# EAGLE design pet_csadapter-v1.2a (EAGLE 4.15)
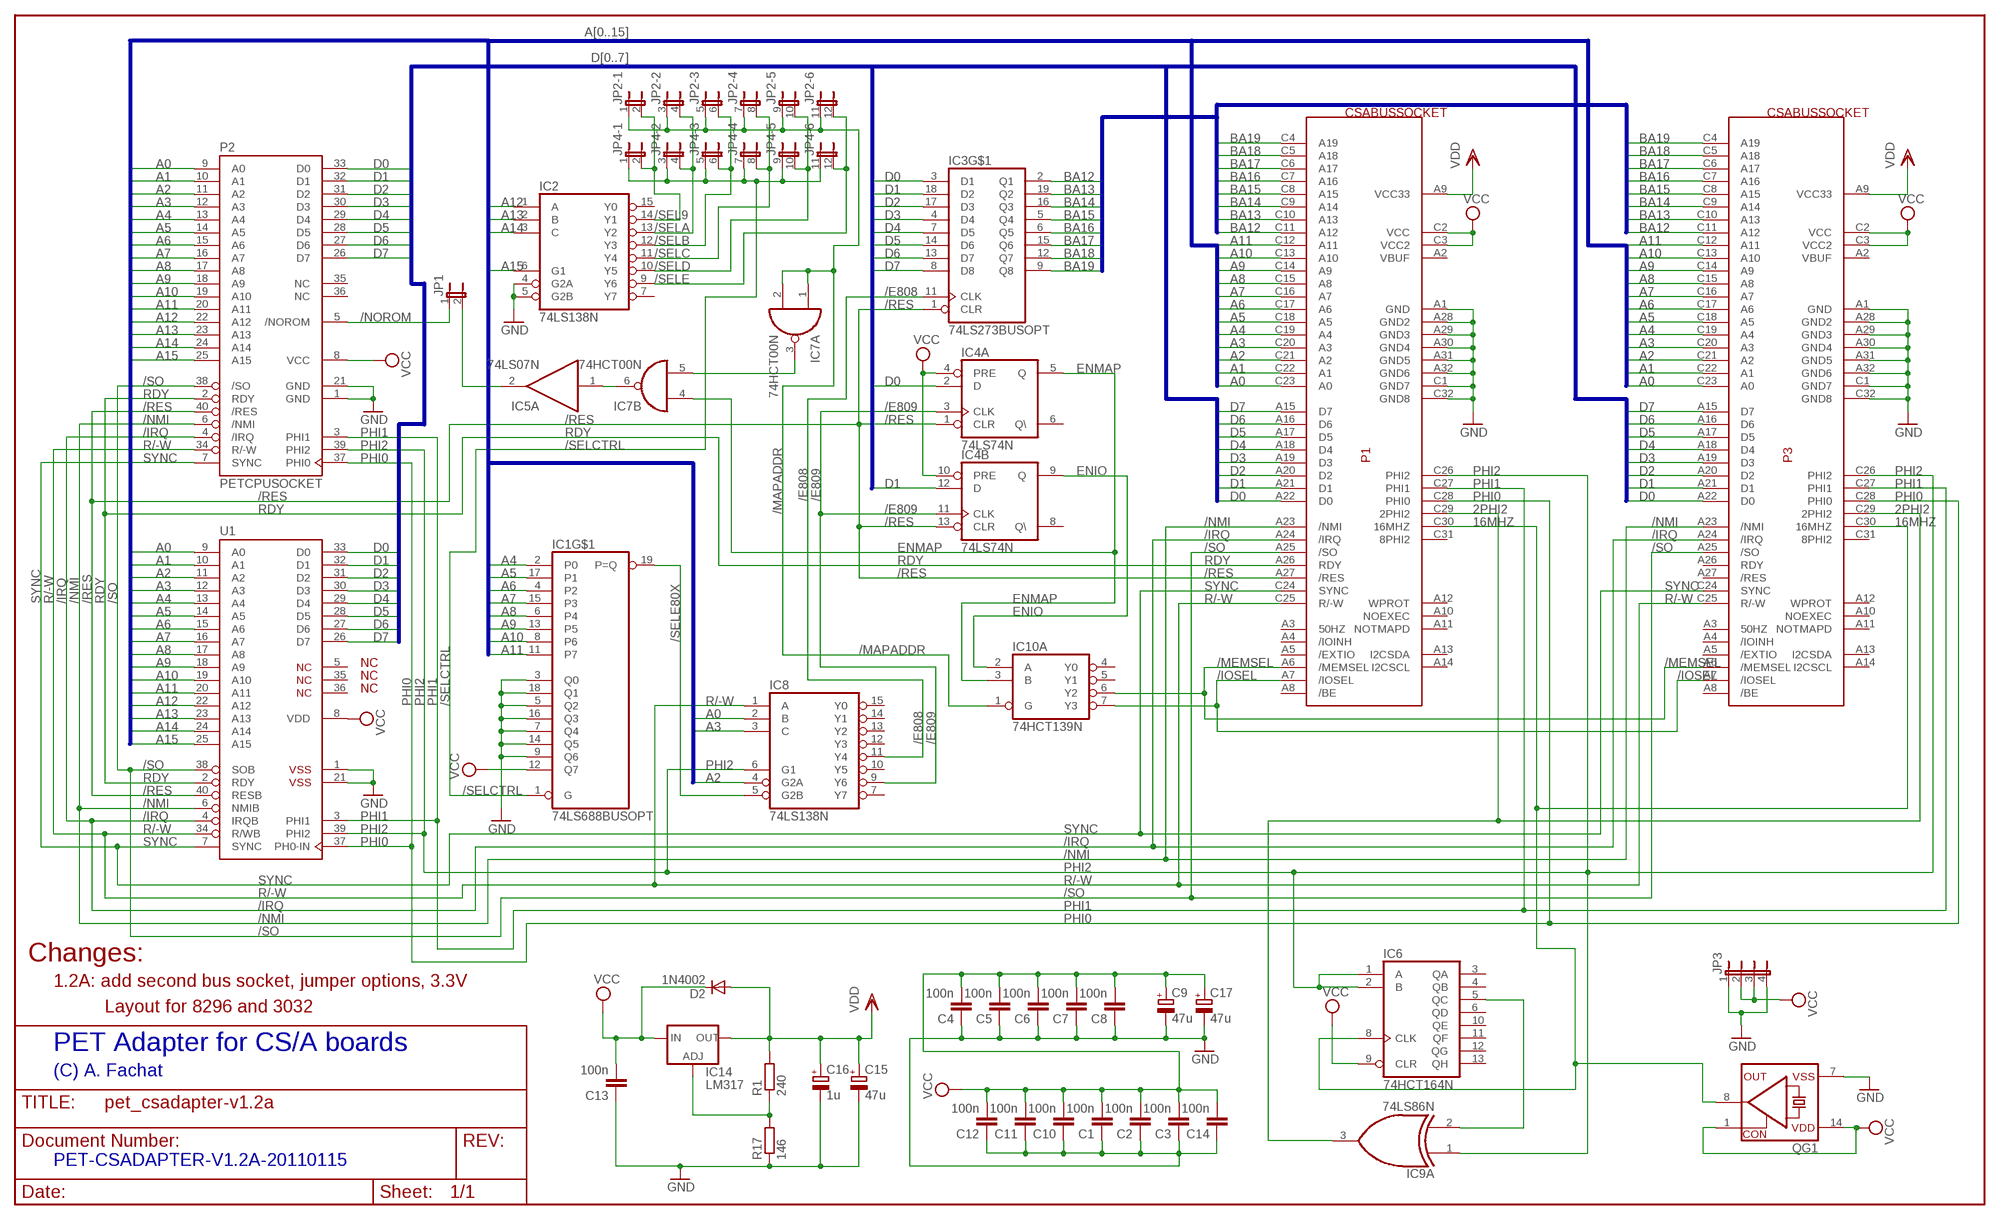
[diagram p0: schematic, sheet 1]

## Parts
C1  100n  C-EU025-025X050  [C025-025X050]
C2  100n  C-EU025-025X050  [C025-025X050]
C3  100n  C-EU025-025X050  [C025-025X050]
C4  100n  C-EU025-025X050  [C025-025X050]
C5  100n  C-EU025-025X050  [C025-025X050]
C6  100n  C-EU025-025X050  [C025-025X050]
C7  100n  C-EU025-025X050  [C025-025X050]
C8  100n  C-EU025-025X050  [C025-025X050]
C9  47u  CPOL-EUE2.5-5  [E2,5-5]
C10  100n  C-EU025-025X050  [C025-025X050]
C11  100n  C-EU025-025X050  [C025-025X050]
C12  100n  C-EU025-025X050  [C025-025X050]
C13  100n  C5/2.5  [C5B2.5]
C14  100n  C-EU025-025X050  [C025-025X050]
C15  47u  CPOL-EUE2-5  [E2-5]
C16  1u  CPOL-EUE2.5-5  [E2,5-5]
C17  47u  CPOL-EUE2.5-5  [E2,5-5]
D2  1N4002  DIODE-C1702-15  [C1702-15]
IC1  74LS688BUSOPT  [DIL20]
IC2  74LS138N  [DIL16]
IC3  74LS273BUSOPT  [DIL20]
IC4  74LS74N  [DIL14]
IC5  74LS07N  [DIL14]
IC6  74HCT164N  [DIL14]
IC7  74HCT00N  [DIL14]
IC8  74LS138N  [DIL16]
IC9  74LS86N  [DIL14]
IC10  74HCT139N  [DIL16]
IC14  LM317  LM317TL  [317TL]
JP1  JP1E  [JP1]
JP2  JP6QE  [JP6Q]
JP3  JP4E  [JP4]
JP4  JP6QE  [JP6Q]
P1  CSABUSSOCKET  [CSABUSSOCK]
P2  PETCPUSOCKET  [DIL40]
P3  CSABUSSOCKET  [CSABUSSOCK]
QG1  CRYSTAL_RES-SG51  [SG51]
R1  240  R-EU_0204/5  [0204/5]
R17  146  R-EU_0204/5  [0204/5]
U1  G65SC02P  [DIP-40]

## Nets
2PHI2: IC9.3(A:O) P1.C29(2PHI2) P3.C29(2PHI2)
16MHZ: IC6.8(CLK) P1.C30(16MHZ) P3.C30(16MHZ) QG1.8(OUT)
/E808: IC3.11(CLK) IC8.11(Y4)
/E809: IC4.3(A:CLK) IC4.11(B:CLK) IC8.9(Y6)
/IOSEL: IC10.7(A:Y3) P1.A7(/IOSEL) P3.A7(/IOSEL)
/IRQ: P1.A24(/IRQ) P2.4(/IRQ) P3.A24(/IRQ) U1.4(IRQB)
/MAPADDR: IC7.1(A:I0) IC7.2(A:I1) IC10.1(A:G) JP2.1 JP2.3 JP2.5 JP2.7 JP2.9 JP2.11
/MEMSEL: IC10.6(A:Y2) P1.A6(/MEMSEL) P3.A6(/MEMSEL)
/NMI: P1.A23(/NMI) P2.6(/NMI) P3.A23(/NMI) U1.6(NMIB)
/NOROM: JP1.1 P2.5(/NOROM)
/RES: IC3.1(CLR) IC4.1(A:CLR) IC4.13(B:CLR) P1.A27(/RES) P2.40(/RES) U1.40(RESB)
/SEL9: IC2.14(Y1) JP2.2 JP4.2
/SELA: IC2.13(Y2) JP2.4 JP4.4
/SELB: IC2.12(Y3) JP2.6 JP4.6
/SELC: IC2.11(Y4) JP2.8 JP4.8
/SELCTRL: IC1.1(G) JP4.1 JP4.3 JP4.5 JP4.7 JP4.9 JP4.11
/SELD: IC2.10(Y5) JP2.10 JP4.10
/SELE: IC2.9(Y6) JP2.12 JP4.12
/SELE80X: IC1.19(P=Q) IC8.5(G2B)
/SO: P1.A25(/SO) P2.38(/SO) P3.A25(/SO) U1.38(SOB)
A0: IC8.2(B) P1.C23(A0) P2.9(A0) P3.C23(A0) U1.9(A0)
A1: P1.C22(A1) P2.10(A1) P3.C22(A1) U1.10(A1)
A2: IC8.4(G2A) P1.C21(A2) P2.11(A2) P3.C21(A2) U1.11(A2)
A3: IC8.3(C) P1.C20(A3) P2.12(A3) P3.C20(A3) U1.12(A3)
A4: IC1.2(P0) P1.C19(A4) P2.13(A4) P3.C19(A4) U1.13(A4)
A5: IC1.17(P1) P1.C18(A5) P2.14(A5) P3.C18(A5) U1.14(A5)
A6: IC1.4(P2) P1.C17(A6) P2.15(A6) P3.C17(A6) U1.15(A6)
A7: IC1.15(P3) P1.C16(A7) P2.16(A7) P3.C16(A7) U1.16(A7)
A8: IC1.6(P4) P1.C15(A8) P2.17(A8) P3.C15(A8) U1.17(A8)
A9: IC1.13(P5) P1.C14(A9) P2.18(A9) P3.C14(A9) U1.18(A9)
A10: IC1.8(P6) P1.C13(A10) P2.19(A10) P3.C13(A10) U1.19(A10)
A11: IC1.11(P7) P1.C12(A11) P2.20(A11) P3.C12(A11) U1.20(A11)
A12: IC2.1(A) P2.22(A12) U1.22(A12)
A13: IC2.2(B) P2.23(A13) U1.23(A13)
A14: IC2.3(C) P2.24(A14) U1.24(A14)
A15: IC2.6(G1) P2.25(A15) U1.25(A15)
BA12: IC3.2(Q1) P1.C11(A12) P3.C11(A12)
BA13: IC3.19(Q2) P1.C10(A13) P3.C10(A13)
BA14: IC3.16(Q3) P1.C9(A14) P3.C9(A14)
BA15: IC3.5(Q4) P1.C8(A15) P3.C8(A15)
BA16: IC3.6(Q5) P1.C7(A16) P3.C7(A16)
BA17: IC3.15(Q6) P1.C6(A17) P3.C6(A17)
BA18: IC3.12(Q7) P1.C5(A18) P3.C5(A18)
BA19: IC3.9(Q8) P1.C4(A19) P3.C4(A19)
D0: IC3.3(D1) IC4.2(A:D) P1.A22(D0) P2.33(D0) P3.A22(D0) U1.33(D0)
D1: IC3.18(D2) IC4.12(B:D) P1.A21(D1) P2.32(D1) P3.A21(D1) U1.32(D1)
D2: IC3.17(D3) P1.A20(D2) P2.31(D2) P3.A20(D2) U1.31(D2)
D3: IC3.4(D4) P1.A19(D3) P2.30(D3) P3.A19(D3) U1.30(D3)
D4: IC3.7(D5) P1.A18(D4) P2.29(D4) P3.A18(D4) U1.29(D4)
D5: IC3.14(D6) P1.A17(D5) P2.28(D5) P3.A17(D5) U1.28(D5)
D6: IC3.13(D7) P1.A16(D6) P2.27(D6) P3.A16(D6) U1.27(D6)
D7: IC3.8(D8) P1.A15(D7) P2.26(D7) P3.A15(D7) U1.26(D7)
ENIO: IC4.9(B:Q) IC10.2(A:A)
ENMAP: IC4.5(A:Q) IC7.4(B:I0) IC10.3(A:B)
GND: C1.1 C2.1 C3.1 C4.1 C5.1 C6.1 C7.1 C8.1 C9.- C10.1 C11.1 C12.1 C13.1 C14.1 C15.- C16.- C17.- IC1.3(Q0) IC1.5(Q2) IC1.7(Q4) IC1.9(Q6) IC1.14(Q5) IC1.16(Q3) IC1.18(Q1) IC2.4(G2A) IC2.5(G2B) JP3.1 JP3.4 P1.A1(GND) P1.A28(GND2) P1.A29(GND3) P1.A30(GND4) P1.A31(GND5) P1.A32(GND6) P1.C1(GND7) P1.C32(GND8) P2.1(GND) P2.21(GND) P3.A1(GND) P3.A28(GND2) P3.A29(GND3) P3.A30(GND4) P3.A31(GND5) P3.A32(GND6) P3.C1(GND7) P3.C32(GND8) QG1.7(VSS) R17.1 U1.1(VSS$1) U1.21(VSS$2)
N$1: IC5.2(A:O) JP1.2
N$2: IC14.1(ADJ) R1.1 R17.2
N$5: IC6.5(QC) IC9.2(A:I1)
N$7: IC5.1(A:I) IC7.6(B:O)
N$9: IC7.3(A:O) IC7.5(B:I1)
PHI0: P1.C28(PHI0) P2.37(PHI0) P3.C28(PHI0) U1.37(PH0-IN)
PHI1: P1.C27(PHI1) P2.3(PHI1) P3.C27(PHI1) U1.3(PHI1)
PHI2: IC6.1(A) IC6.2(B) IC8.6(G1) IC9.1(A:I0) P1.C26(PHI2) P2.39(PHI2) P3.C26(PHI2) U1.39(PHI2)
R/-W: IC8.1(A) P1.C25(R/-W) P2.34(R/-W) P3.C25(R/-W) U1.34(R/WB)
RDY: P1.A26(RDY) P2.2(RDY) U1.2(RDY)
SYNC: P1.C24(SYNC) P2.7(SYNC) P3.C24(SYNC) U1.7(SYNC)
VCC: C1.2 C2.2 C3.2 C4.2 C5.2 C6.2 C7.2 C8.2 C9.+ C10.2 C11.2 C12.2 C13.2 C14.2 C17.+ D2.C IC1.12(Q7) IC4.4(A:PRE) IC4.10(B:PRE) IC6.9(CLR) IC14.3(IN) JP3.2 JP3.3 P1.C2(VCC) P1.C3(VCC2) P2.8(VCC) P3.C2(VCC) P3.C3(VCC2) QG1.1(CON) QG1.14(VDD) U1.8(VDD)
VDD: C15.+ C16.+ D2.A IC14.2(OUT) P1.A9(VCC33) P3.A9(VCC33) R1.2
Unconnected: IC2.7(Y7) IC2.15(Y0) IC4.6(A:Q\) IC4.8(B:Q\) IC5.3(B:I) IC5.4(B:O) IC5.5(C:I) IC5.6(C:O) IC5.8(D:O) IC5.9(D:I) IC5.10(E:O) IC5.11(E:I) IC5.12(F:O) IC5.13(F:I) IC6.3(QA) IC6.4(QB) IC6.6(QD) IC6.10(QE) IC6.11(QF) IC6.12(QG) IC6.13(QH) IC7.8(C:O) IC7.9(C:I0) IC7.10(C:I1) IC7.11(D:O) IC7.12(D:I0) IC7.13(D:I1) IC8.7(Y7) IC8.10(Y5) IC8.12(Y3) IC8.13(Y2) IC8.14(Y1) IC8.15(Y0) IC9.4(B:I0) IC9.5(B:I1) IC9.6(B:O) IC9.8(C:O) IC9.9(C:I0) IC9.10(C:I1) IC9.11(D:O) IC9.12(D:I0) IC9.13(D:I1) IC10.4(A:Y0) IC10.5(A:Y1) IC10.9(B:Y3) IC10.10(B:Y2) IC10.11(B:Y1) IC10.12(B:Y0) IC10.13(B:B) IC10.14(B:A) IC10.15(B:G) P1.A2(VBUF) P1.A3(50HZ) P1.A4(/IOINH) P1.A5(/EXTIO) P1.A8(/BE) P1.A10(NOEXEC) P1.A11(NOTMAPD) P1.A12(WPROT) P1.A13(I2CSDA) P1.A14(I2CSCL) P1.C31(8PHI2) P2.35(NC) P2.36(NC) P3.A2(VBUF) P3.A3(50HZ) P3.A4(/IOINH) P3.A5(/EXTIO) P3.A8(/BE) P3.A10(NOEXEC) P3.A11(NOTMAPD) P3.A12(WPROT) P3.A13(I2CSDA) P3.A14(I2CSCL) P3.A26(RDY) P3.A27(/RES) P3.C31(8PHI2) U1.5(NC$1) U1.35(NC$2) U1.36(NC$3)

## Buses
D[0..7]
A[0..15]
BA[12..19]

## Notes on the sheet
- Changes:
- 1.2A: add second bus socket, jumper options, 3.3V
- Layout for 8296 and 3032
- PET Adapter for CS/A boards
- (C) A. Fachat
- PET-CSADAPTER-V1.2A-20110115

## Power pins joined to a net without a drawn wire
GND: IC1.10(GND) IC2.8(GND) IC3.10(GND) IC4.7(P:GND) IC5.7(P:GND) IC6.7(GND) IC7.7(P:GND) IC8.8(GND) IC9.7(P:GND) IC10.8(P:GND)
VCC: IC1.20(VCC) IC2.16(VCC) IC3.20(VCC) IC4.14(P:VCC) IC5.14(P:VCC) IC6.14(VCC) IC7.14(P:VCC) IC8.16(VCC) IC9.14(P:VCC) IC10.16(P:VCC)

## Library data of the parts
C1-C8 C10-C12 C14 = rcl:C-EU: CAPACITOR, European symbol
C9 C15-C17 = rcl:CPOL-EU: POLARIZED CAPACITOR, European symbol
C13 = capacitor-wima:C: CAPACITOR naming: grid - package width
D2 = diode:DIODE-: DIODE
IC1 = csa:74LS688BUSOPT
IC2 IC8 = 74xx-us:74*138: 3-line to 8-line DECODER/DEMULTIPLEXER
IC3 = csa:74LS273BUSOPT
IC4 = 74xx-us:74*74: Dual D type positive edge triggered FLIP FLOP, preset and clear
IC5 = 74xx-eu:74*07: Hex BUFFER, open collector high-voltage output
IC6 = 74xx-eu:74*164: 8-bit parallel out SHIFT REGISTER
IC7 = 74xx-eu:74*00: Quad 2-input NAND gate
IC9 = 74xx-us:74*86: Quad 2-input EXCLUSIV-OR (XOR) gate
IC10 = 74xx-eu:74*139: Dual 2-line to 4-line DECODER/DEMULTIPLEXER
IC14 = v-reg:LM317TL: VOLTAGE REGULATOR
JP1 = jumper:JP1E: JUMPER
JP2 JP4 = jumper:JP6QE: JUMPER
JP3 = jumper:JP4E: JUMPER
P1 P3 = csa:CSABUS
P2 = csa:PETCPUSOCKET
QG1 = crystal:CRYSTAL_RES-: CRYSTAL RESONATOR
R1 R17 = rcl:R-EU_: RESISTOR, European symbol
U1 = 65xxx:G65SC02P: California Micro Devices Version

## Board
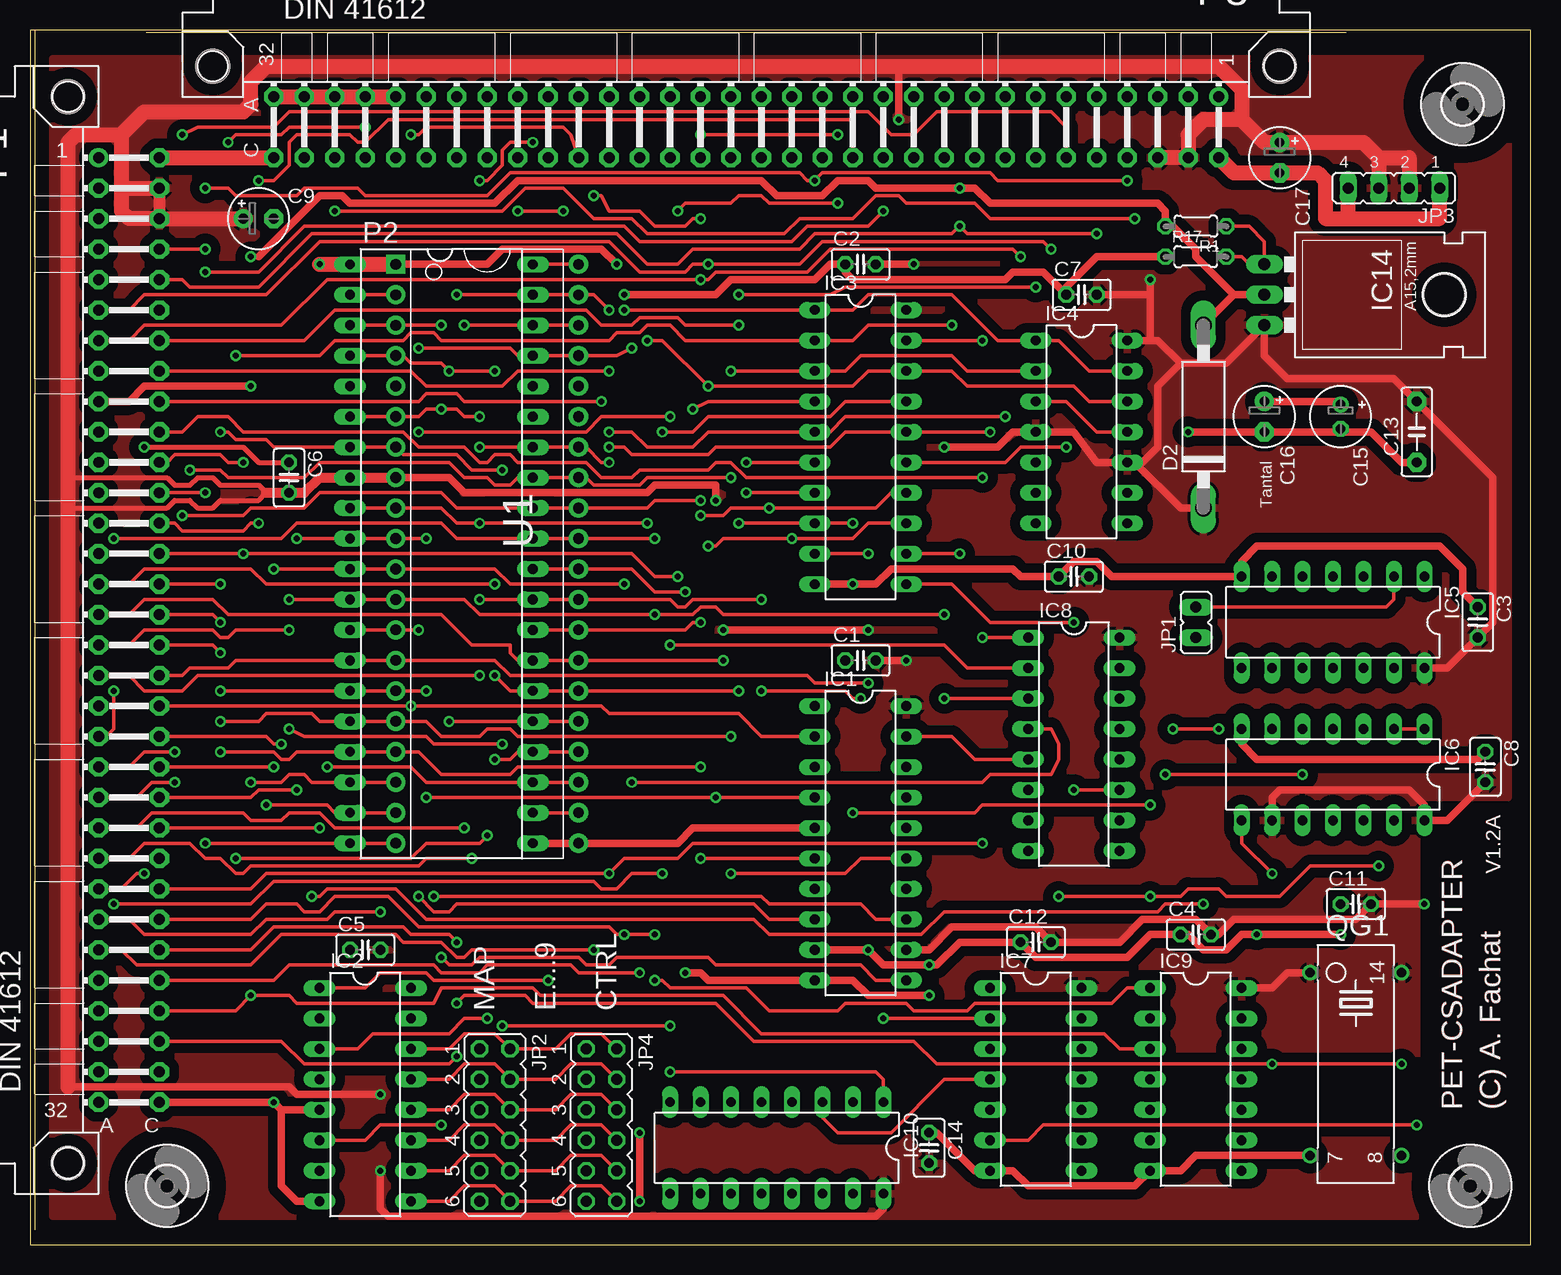
[diagram p1: board, top side]
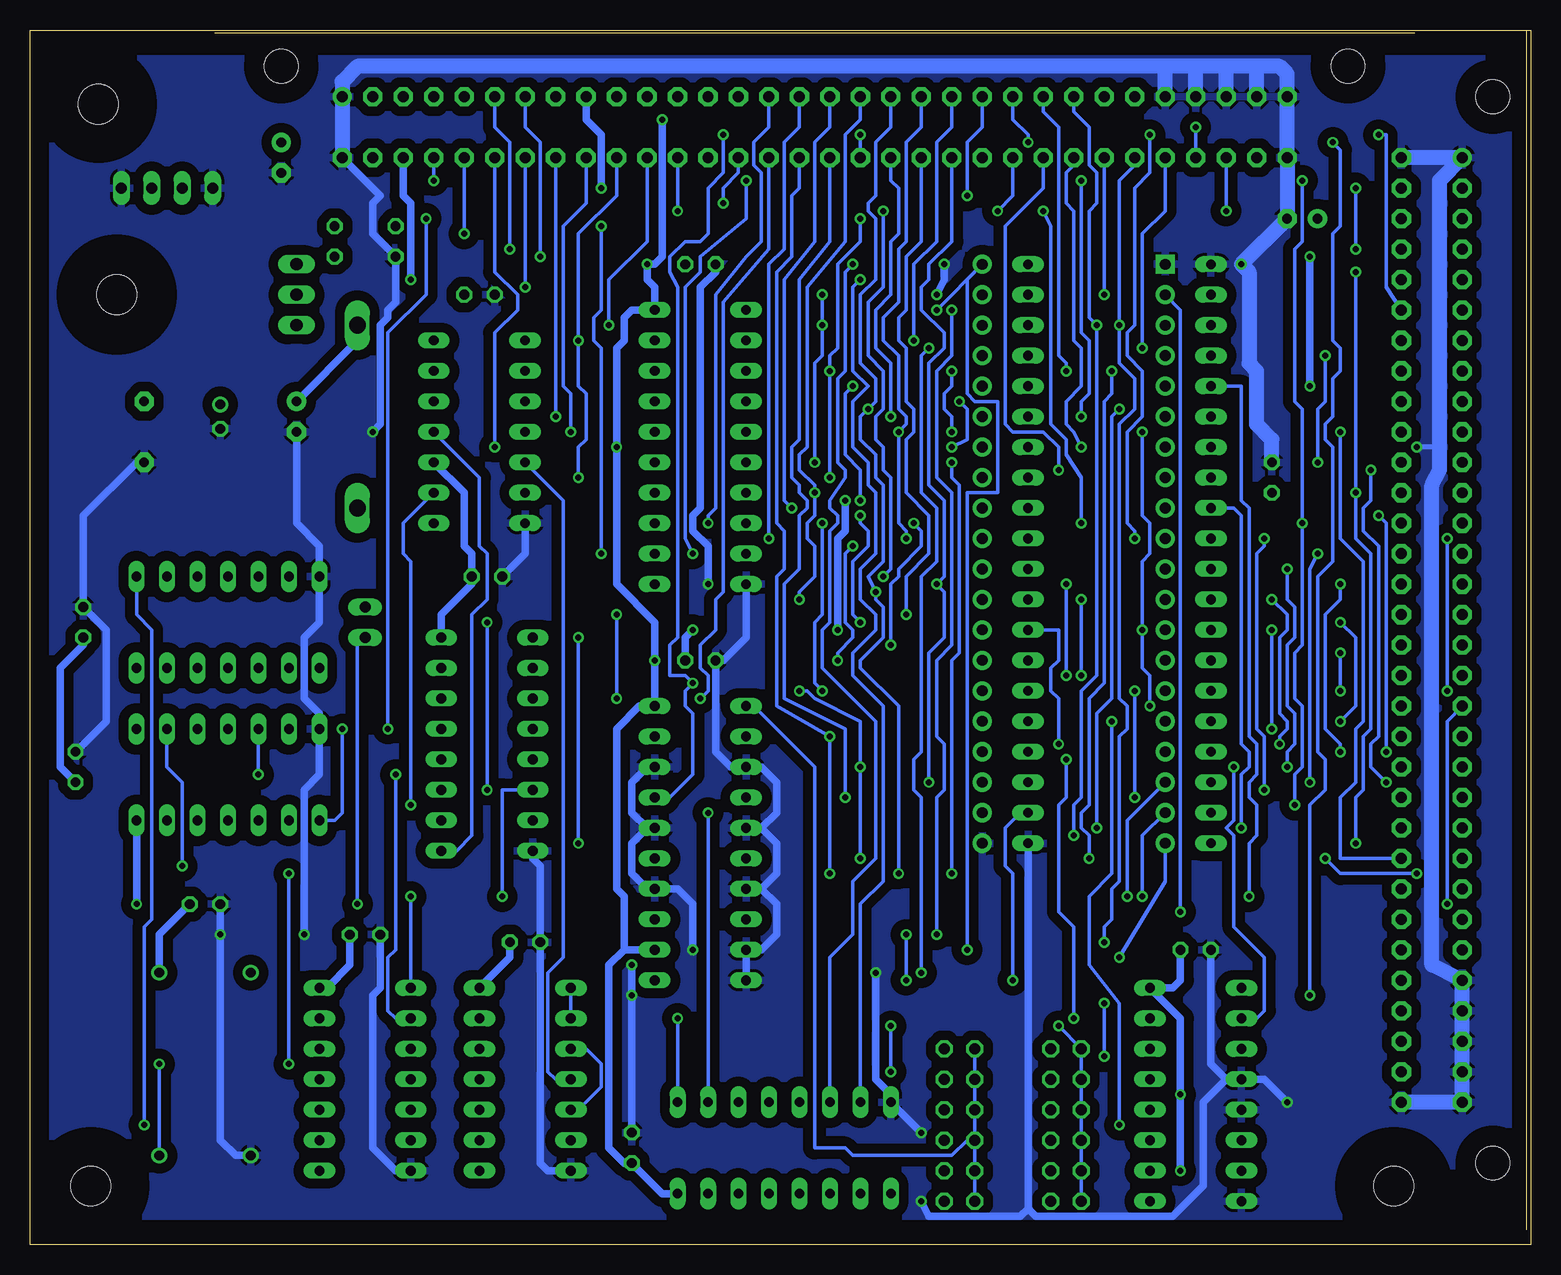
[diagram p2: board, bottom side, seen from below]

Size 125.07 x 101.28 mm. Coordinates in mm from the lower left corner, seen from the top.
Outline: 0,0 125.07,0 125.07,101.27 0,101.27 0,0
Copper layers (1*16): Top 0.035mm / dielectric 1.5mm / Bottom 0.035mm
Design rules "default": minimum track width 10mil, minimum drill 12mil, track to track 6mil, track to pad 6mil, pad to pad 6mil, via to via 6mil, smd to smd 6mil, copper to edge 40mil, drill to drill 8mil, minimum pad ring 10mil, minimum via ring 8mil, stop-mask expansion 4mil, vias tented up to drill 0mil, thermal gap 10mil

### Footprints (pad centres in the part's own frame; a part is rotated, then mirrored left to right if it is on the bottom)
C025-025X050 = drill 0.813 octagon: 1 -1.27,0; 2 1.27,0
E2,5-5 = drill 0.813 pad 1.6 round: + -1.27,0 | drill 0.813 pad 1.6 octagon: - 1.27,0
C5B2.5 = drill 0.813 pad 1.6 octagon: 1 -2.54,0; 2 2.54,0
E2-5 = drill 0.813 pad 1.27 round: + -1.016,0 | drill 0.813 pad 1.27 octagon: - 1.016,0
C1702-15 = drill 1.397 long: A 7.62,0; C -7.62,0
DIL20 = drill 0.813 long: 1 -10.16,-3.81; 2 -7.62,-3.81; 3 -5.08,-3.81; 4 -2.54,-3.81; 5 0,-3.81; 6 2.54,-3.81; 7 5.08,-3.81; 8 7.62,-3.81; 9 10.16,-3.81; 10 12.7,-3.81; 11 12.7,3.81; 12 10.16,3.81; 13 7.62,3.81; 14 5.08,3.81; 15 2.54,3.81; 16 0,3.81; 17 -2.54,3.81; 18 -5.08,3.81; 19 -7.62,3.81; 20 -10.16,3.81
DIL16 = drill 0.813 long: 1 -8.89,-3.81; 2 -6.35,-3.81; 3 -3.81,-3.81; 4 -1.27,-3.81; 5 1.27,-3.81; 6 3.81,-3.81; 7 6.35,-3.81; 8 8.89,-3.81; 9 8.89,3.81; 10 6.35,3.81; 11 3.81,3.81; 12 1.27,3.81; 13 -1.27,3.81; 14 -3.81,3.81; 15 -6.35,3.81; 16 -8.89,3.81
DIL14 = drill 0.813 long: 1 -7.62,-3.81; 2 -5.08,-3.81; 3 -2.54,-3.81; 4 0,-3.81; 5 2.54,-3.81; 6 5.08,-3.81; 7 7.62,-3.81; 8 7.62,3.81; 9 5.08,3.81; 10 2.54,3.81; 11 0,3.81; 12 -2.54,3.81; 13 -5.08,3.81; 14 -7.62,3.81
317TL = drill 1.016 long: 1 -2.54,-3.81; 2 0,-3.81; 3 2.54,-3.81 | hole 3.302: 0,11.176
JP1 = drill 0.914 long: 1 0,-1.27; 2 0,1.27
JP6Q = drill 0.914 octagon: 1 -6.35,-1.27; 2 -6.35,1.27; 3 -3.81,-1.27; 4 -3.81,1.27; 5 -1.27,-1.27; 6 -1.27,1.27; 7 1.27,-1.27; 8 1.27,1.27; 9 3.81,-1.27; 10 3.81,1.27; 11 6.35,-1.27; 12 6.35,1.27
JP4 = drill 0.914 long: 1 -3.81,0; 2 -1.27,0; 3 1.27,0; 4 3.81,0
CSABUSSOCK = drill 0.914 pad 1.6 round: A1 -7.62,-39.37 | drill 0.914 pad 1.6 octagon: A2 -7.62,-36.83; A3 -7.62,-34.29; A4 -7.62,-31.75; A5 -7.62,-29.21; A6 -7.62,-26.67; A7 -7.62,-24.13; A8 -7.62,-21.59; A9 -7.62,-19.05; A10 -7.62,-16.51; A11 -7.62,-13.97; A12 -7.62,-11.43; A13 -7.62,-8.89; A14 -7.62,-6.35; A15 -7.62,-3.81; A16 -7.62,-1.27; A17 -7.62,1.27; A18 -7.62,3.81; A19 -7.62,6.35; A20 -7.62,8.89; A21 -7.62,11.43; A22 -7.62,13.97; A23 -7.62,16.51; A24 -7.62,19.05; A25 -7.62,21.59; A26 -7.62,24.13; A27 -7.62,26.67; A28 -7.62,29.21; A29 -7.62,31.75; A30 -7.62,34.29; A31 -7.62,36.83; A32 -7.62,39.37; C1 -12.7,-39.37; C2 -12.7,-36.83; C3 -12.7,-34.29; C4 -12.7,-31.75; C5 -12.7,-29.21; C6 -12.7,-26.67; C7 -12.7,-24.13; C8 -12.7,-21.59; C9 -12.7,-19.05; C10 -12.7,-16.51; C11 -12.7,-13.97; C12 -12.7,-11.43; C13 -12.7,-8.89; C14 -12.7,-6.35; C15 -12.7,-3.81; C16 -12.7,-1.27; C17 -12.7,1.27; C18 -12.7,3.81; C19 -12.7,6.35; C20 -12.7,8.89; C21 -12.7,11.43; C22 -12.7,13.97; C23 -12.7,16.51; C24 -12.7,19.05; C25 -12.7,21.59; C26 -12.7,24.13; C27 -12.7,26.67; C28 -12.7,29.21; C29 -12.7,31.75; C30 -12.7,34.29; C31 -12.7,36.83; C32 -12.7,39.37 | hole 2.794: -5.08,44.45; -5.08,-44.45
DIL40 = drill 0.813 long: 1 -16.51,-7.62; 2 -13.97,-7.62; 3 -11.43,-7.62; 4 -8.89,-7.62; 5 -6.35,-7.62; 6 -3.81,-7.62; 7 -1.27,-7.62; 8 1.27,-7.62; 9 3.81,-7.62; 10 6.35,-7.62; 11 8.89,-7.62; 12 11.43,-7.62; 13 13.97,-7.62; 14 16.51,-7.62; 15 19.05,-7.62; 16 21.59,-7.62; 17 24.13,-7.62; 18 26.67,-7.62; 19 29.21,-7.62; 20 31.75,-7.62; 21 31.75,7.62; 22 29.21,7.62; 23 26.67,7.62; 24 24.13,7.62; 25 21.59,7.62; 26 19.05,7.62; 27 16.51,7.62; 28 13.97,7.62; 29 11.43,7.62; 30 8.89,7.62; 31 6.35,7.62; 32 3.81,7.62; 33 1.27,7.62; 34 -1.27,7.62; 35 -3.81,7.62; 36 -6.35,7.62; 37 -8.89,7.62; 38 -11.43,7.62; 39 -13.97,7.62; 40 -16.51,7.62
SG51 = drill 0.813 round: 1 -7.62,-3.81; 7 7.62,-3.81; 8 7.62,3.81; 14 -7.62,3.81
0204/5 = drill 0.813 octagon: 1 -2.54,0; 2 2.54,0
DIP-40 = drill 0.889 pad 1.6 square: 1 -22.86,-7.62 | drill 0.889 pad 1.6 round: 2 -20.32,-7.62; 3 -17.78,-7.62; 4 -15.24,-7.62; 5 -12.7,-7.62; 6 -10.16,-7.62; 7 -7.62,-7.62; 8 -5.08,-7.62; 9 -2.54,-7.62; 10 0,-7.62; 11 2.54,-7.62; 12 5.08,-7.62; 13 7.62,-7.62; 14 10.16,-7.62; 15 12.7,-7.62; 16 15.24,-7.62; 17 17.78,-7.62; 18 20.32,-7.62; 19 22.86,-7.62; 20 25.4,-7.62; 21 25.4,7.62; 22 22.86,7.62; 23 20.32,7.62; 24 17.78,7.62; 25 15.24,7.62; 26 12.7,7.62; 27 10.16,7.62; 28 7.62,7.62; 29 5.08,7.62; 30 2.54,7.62; 31 0,7.62; 32 -2.54,7.62; 33 -5.08,7.62; 34 -7.62,7.62; 35 -10.16,7.62; 36 -12.7,7.62; 37 -15.24,7.62; 38 -17.78,7.62; 39 -20.32,7.62; 40 -22.86,7.62
3,3 = hole 3.3: 0,0

### Placement (x,y rotation side)
C1  69.21,48.73 0 top
C2  69.21,81.75 0 top
C3  120.64,51.91 270 top
C4  97.15,25.87 0 top
C5  27.93,24.6 0 top
C6  21.59,63.97 270 top
C7  87.62,79.21 0 top
C8  121.28,39.84 270 top
C9  19.05,85.56 0 top
C10  86.99,55.71 0 top
C11  110.48,28.41 0 top
C12  83.81,25.23 0 top
C13  115.56,67.78 90 top
C14  74.92,8.09 270 top
C15  109.21,69.05 270 top
C16  102.86,69.05 270 top
C17  104.13,90.64 270 top
D2  97.78,69.05 90 top
IC1  69.21,34.76 270 top
IC2  27.93,12.54 270 top
IC3  69.21,67.78 270 top
IC4  87.62,67.78 270 top
IC5  108.58,51.91 180 top
IC6  108.58,39.2 180 top
IC7  83.81,13.81 270 top
IC8  86.99,41.74 270 top
IC9  97.15,13.81 270 top
IC10  62.23,8.09 180 top
IC14  106.67,79.21 270 top
JP1  97.15,51.91 0 top
JP2  38.73,10 270 top
JP3  113.66,88.1 180 top
JP4  47.62,10 270 top
P1  -1.91,51.27 180 top
P2  34.29,65.24 270 top
P3  59.69,103.34 90 top
QG1  110.48,15.08 270 top
R1  97.15,84.92 180 top
R17  97.15,82.39 0 top
U1  38.09,58.89 270 top
U$1  [3,3]  11.43,4.92 0 top
U$2  [3,3]  119.38,95.08 0 top
U$3  [3,3]  120.01,4.92 0 top

### Tracks (layer width: path | path; a pad name or v marks a point on that pad's centre or on a via)
2PHI2  (via drill 0.5)
  Top 0.305: P1.C29 17.14,19.52 v18.41,20.79 21.59,20.79 22.22,20.15 33.65,20.15 34.29,21.42 41.91,21.42 42.54,20.79 57.78,20.79 60.96,17.61 89.53,17.61 90.8,16.34 IC9.3 | v16.5,91.91 17.14,92.55 20.95,92.55 21.59,93.18 v27.93,93.18
  Bottom 0.305: v18.41,20.79 18.41,36.66 17.14,37.94 17.14,40.48 17.77,41.11 17.77,55.71 16.5,56.98 16.5,66.51 17.14,67.14 17.14,68.41 16.5,69.05 16.5,72.22 15.87,72.86 15.87,74.77 16.5,75.4 16.5,84.29 15.87,84.92 15.87,91.28 v16.5,91.91 | v27.93,93.18 P3.C29
16MHZ  (via drill 0.5)
  Top 0.305: P1.C30 20.95,16.98 22.86,15.08 34.92,15.08 v35.55,15.71 | v35.55,20.15 36.19,20.79 41.27,20.79 41.91,20.15 57.15,20.15 60.32,16.98 73.65,16.98 75.56,15.08 v103.5,15.08 v114.29,15.08 | v25.39,86.19 39.37,86.19 41.27,88.1 44.45,88.1 46.98,85.56 50.16,85.56 51.43,84.29 62.86,84.29 64.13,85.56 68.57,85.56 70.48,87.47 72.38,87.47 73.02,86.83 78.73,86.83 80,85.56 v92.07,85.56 | IC6.8 100.96,33.49 v103.5,30.95 | v99.05,43.02 v95.24,43.02
  Bottom 0.305: v35.55,15.71 v35.55,20.15 | v25.39,86.19 P3.C30 | v114.29,15.08 QG1.8 | v103.5,15.08 v103.5,30.95 | IC6.8 99.69,35.39 99.05,36.03 v99.05,43.02 | v95.24,43.02 95.24,76.03 92.07,79.21 v92.07,85.56
/E808  (via drill 0.5)
  Top 0.305: v86.99,37.94 IC8.11 | v86.99,51.91 80,51.91 76.83,55.08 IC3.11
  Bottom 0.305: v86.99,37.94 v86.99,51.91
/E809
  Top 0.305: IC4.3 86.35,70.32 88.89,67.78 IC4.11
  Bottom 0.305: IC8.9 89.53,32.85 88.26,34.12 88.26,52.54 86.99,53.81 86.99,57.62 87.62,58.25 87.62,63.97 IC4.11
/IOSEL  (via drill 0.5)
  Top 0.305: P1.A7 8.25,75.4 9.52,76.67 20.95,76.67 24.76,80.48 v55.88,80.48 56.51,80.48 57.15,81.11 64.76,81.11 66.67,83.02 81.91,83.02 v82.54,82.39
  Bottom 0.305: v82.54,82.39 82.54,91.91 83.81,93.18 P3.A7 | v55.88,80.48 56.51,79.84 56.51,72.86 55.24,71.59 56.51,70.32 56.51,66.51 55.24,65.24 55.24,63.34 54.6,62.7 54.6,57.62 55.88,56.35 55.88,53.81 54.6,52.54 54.6,51.27 56.51,49.37 56.51,47.46 53.97,44.92 53.97,30.31 55.88,28.41 IC10.7
/IRQ  (via drill 0.5)
  Top 0.305: P2.4 U1.4 31.11,74.13 31.74,73.5 34.29,73.5 v34.92,72.86 v38.73,72.86 | P1.A24 8.25,32.22 9.52,33.49 13.33,33.49 14.6,32.22 15.87,32.22 17.14,30.95 17.77,30.95 18.41,31.58 32.38,31.58 33.02,32.22 v36.83,32.22
  Bottom 0.305: v36.83,32.22 36.83,34.12 37.46,34.76 37.46,36.03 36.83,36.66 36.83,45.55 35.55,46.82 35.55,70.32 34.92,70.95 v34.92,72.86 | P3.A24 40.63,94.45 39.37,93.18 39.37,74.13 38.73,73.5 v38.73,72.86
/MAPADDR  (via drill 0.5)
  Top 0.305: v53.34,14.44 70.48,14.44 71.11,13.81 IC10.1 | v39.37,18.25 v53.34,18.25 | v71.11,18.88 IC7.2
  Bottom 0.305: JP2.3 JP2.1 | JP2.3 JP2.5 JP2.7 JP2.9 JP2.11 | JP2.3 JP2.1 | JP2.1 v39.37,18.25 | v53.34,18.25 v53.34,14.44 | IC7.2 IC7.1 | IC10.1 v71.11,18.88
/MEMSEL  (via drill 0.5)
  Top 0.305: P1.A6 8.25,77.94 9.52,79.21 19.68,79.21 24.12,83.66 48.26,83.66 50.8,81.11 54.6,81.11 55.24,81.75 v56.51,81.75 64.13,81.75 66.03,83.66 84.45,83.66 v85.08,83.02
  Bottom 0.305: v85.08,83.02 85.08,91.91 86.35,93.18 P3.A6 | IC10.6 58.41,23.96 56.51,25.87 56.51,30.31 54.6,32.22 54.6,43.65 59.05,48.09 59.05,51.27 58.41,51.91 58.41,59.52 57.78,60.16 57.78,60.8 58.41,61.43 58.41,62.06 57.15,63.97 57.15,64.61 57.78,65.24 57.78,72.22 57.15,72.86 57.15,81.11 v56.51,81.75
/NMI  (via drill 0.5)
  Top 0.305: P2.6 U1.6 32.38,69.05 33.02,69.69 v34.29,69.69 35.55,69.69 36.19,69.05 v37.46,69.05 | P1.A23 8.88,34.76 10.16,36.03 17.77,36.03 18.41,35.39 20.95,35.39 21.59,36.03 24.12,36.03 25.39,34.76 v36.19,34.76 | v37.46,88.73 38.09,88.73 39.37,90 39.37,91.28 40,91.91 v41.91,91.91
  Bottom 0.305: v36.19,34.76 36.19,44.28 34.92,45.55 34.92,69.05 v34.29,69.69 | P3.A23 43.17,93.81 41.91,92.55 v41.91,91.91 | v37.46,69.05 37.46,70.32 36.83,70.95 36.83,75.4 37.46,76.03 v37.46,88.73
/NOROM  (via drill 0.5)
  Top 0.305: v23.49,29.04 24.12,29.04 24.76,29.68 30.48,29.68 33.02,27.14 60.32,27.14 61.59,25.87 74.29,25.87 76.19,27.77 93.97,27.77 94.61,28.41 v97.78,28.41
  Bottom 0.305: P2.5 24.12,71.59 24.12,62.06 23.49,61.43 23.49,42.38 22.86,41.74 22.86,39.2 23.49,38.57 23.49,37.3 22.86,36.66 22.86,34.12 23.49,33.49 v23.49,29.04 | v97.78,28.41 97.78,50 JP1.1
/RES  (via drill 0.5)
  Top 0.305: U1.40 P2.40 | P1.A27 7.62,24.6 8.88,23.33 18.41,23.33 20.95,25.87 30.48,25.87 31.11,25.23 34.29,25.23 35.55,23.96 36.19,23.96 36.83,24.6 v46.98,24.6 | v49.52,77.94 IC3.1 68.57,77.94 69.84,79.21 76.83,79.21 80.64,75.4 IC4.1 85.72,75.4 88.26,72.86 IC4.13
  Bottom 0.305: v46.98,24.6 46.98,62.7 44.45,62.7 44.45,70.32 46.35,70.32 46.98,70.95 46.98,80.48 U1.40 v49.52,77.94
/SEL9
  Top 0.305: IC2.14 34.92,16.34 36.19,17.61 38.73,17.61 JP2.2 43.81,16.34 45.08,17.61 47.62,17.61 JP4.2
/SELA
  Top 0.305: IC2.13 34.92,13.81 36.19,15.08 38.73,15.08 JP2.4 43.81,13.81 45.08,15.08 47.62,15.08 JP4.4
/SELB
  Top 0.305: IC2.12 34.92,11.27 36.19,12.54 38.73,12.54 JP2.6 43.81,11.27 45.08,12.54 47.62,12.54 JP4.6
/SELC
  Top 0.305: IC2.11 34.92,8.73 36.19,10 38.73,10 JP2.8 43.81,8.73 45.08,10 47.62,10 JP4.8
/SELCTRL
  Bottom 0.305: IC1.1 64.76,44.92 59.69,39.84 59.69,8.09 57.15,8.09 56.51,7.46 48.26,7.46 46.98,8.73 JP4.7 | JP4.1 JP4.3 JP4.5 JP4.7 | JP4.7 JP4.9 JP4.11
/SELD
  Top 0.305: IC2.10 34.92,6.18 36.19,7.46 38.73,7.46 JP2.10 43.81,6.18 45.08,7.46 47.62,7.46 JP4.10
/SELE
  Top 0.305: IC2.9 34.92,3.64 36.19,4.92 38.73,4.92 JP2.12 43.81,3.64 45.08,4.92 47.62,4.92 JP4.12
/SELE80X
  Top 0.305: IC1.19 76.83,42.38 78.73,40.48 IC8.5
/SO  (via drill 0.5)
  Top 0.305: U1.38 P2.38 v36.19,76.67 | P1.A25 7.62,29.68 8.88,30.95 v9.52,30.95 | v17.14,32.22 31.74,32.22 33.02,33.49 37.46,33.49 v38.09,34.12
  Bottom 0.305: v9.52,30.95 15.87,30.95 v17.14,32.22 | v38.09,34.12 38.09,36.66 37.46,37.3 37.46,46.19 36.19,47.46 v36.19,76.67 36.83,77.3 36.83,86.19 36.19,86.83 36.19,89.37 36.83,90 36.83,93.18 38.09,94.45 P3.A25
A0  (via drill 0.5)
  Top 0.305: P2.9 U1.9 34.29,61.43 35.55,60.16 v37.46,60.16 v51.43,60.16 | P1.C23 v24.12,34.76 | v40.63,86.19 v44.45,86.19 | v53.34,50 76.19,50 78.1,48.09 IC8.2
  Bottom 0.305: v24.12,34.76 24.12,39.2 23.49,39.84 23.49,41.11 24.12,41.74 24.12,60.8 24.76,61.43 P2.9 | v37.46,60.16 37.46,63.97 38.73,65.88 38.73,67.14 40,68.41 40,84.92 v40.63,86.19 | v44.45,86.19 43.17,87.47 P3.C23 | v51.43,60.16 50.8,59.52 50.8,58.25 52.7,56.35 52.7,55.71 53.34,55.08 v53.34,50
A1  (via drill 0.5)
  Top 0.305: P1.C22 18.41,37.3 19.05,37.94 v22.22,37.94 | v22.22,58.89 P2.10 U1.10 v33.02,58.89 | v31.74,92.55 32.38,92.55 33.02,93.18 44.45,93.18 45.08,92.55 P3.C22
  Bottom 0.305: v22.22,37.94 22.22,42.38 22.86,43.02 22.86,57.62 22.22,58.25 v22.22,58.89 | v33.02,58.89 33.02,59.52 33.65,60.16 33.65,67.78 32.38,69.05 32.38,72.86 33.65,74.13 33.65,76.03 33.02,76.67 33.02,88.1 31.74,89.37 v31.74,92.55
A2  (via drill 0.5)
  Top 0.305: P1.C21 v20.32,39.84 | v20.32,56.35 P2.11 U1.11 38.73,56.35 40,55.08 v49.52,55.08 | v50.16,38.57 79.37,38.57 80,39.2 85.08,39.2 85.72,40.48 85.72,41.74 85.08,43.02 IC8.4
  Bottom 0.305: v20.32,39.84 20.32,41.11 19.68,41.74 19.68,44.28 20.32,44.92 20.32,50 19.68,50.63 19.68,53.17 20.32,53.81 v20.32,56.35 | P3.C21 48.26,83.66 50.16,81.75 50.16,80.48 50.8,79.84 50.8,77.94 48.89,76.03 48.89,74.77 50.16,73.5 50.16,63.34 48.89,62.06 48.89,55.71 v49.52,55.08 48.89,54.45 48.89,50.63 50.16,49.37 v50.16,38.57
A3  (via drill 0.5)
  Top 0.305: P1.C20 19.68,42.38 20.32,41.74 v20.95,41.74 | v21.59,53.81 P2.12 U1.12 36.19,53.81 37.46,52.54 v52.06,52.54 55.24,52.54 55.88,53.17 57.15,53.17 57.78,52.54 v76.19,52.54 | v76.19,45.55 IC8.3
  Bottom 0.305: v20.95,41.74 20.95,42.38 20.32,43.02 20.32,43.65 20.95,44.28 20.95,50.63 20.32,51.27 20.32,52.54 v21.59,53.81 | v52.06,52.54 52.06,55.71 50.16,57.62 50.16,60.8 52.06,62.7 52.06,67.14 51.43,67.78 51.43,69.69 52.06,70.32 52.06,74.77 52.7,75.4 52.7,77.3 52.06,77.94 52.06,82.39 50.8,83.66 P3.C20 | v76.19,52.54 v76.19,45.55
A4  (via drill 0.5)
  Top 0.305: P2.13 U1.13 v32.38,51.27 | IC1.2 60.96,42.38 59.05,44.28 48.26,44.28 47.62,44.92 v31.74,44.92 P1.C19 | v32.38,67.78 46.35,67.78 47.62,69.05 v53.34,69.05
  Bottom 0.305: v31.74,44.92 31.74,47.46 32.38,48.09 v32.38,51.27 32.38,56.98 31.74,57.62 31.74,60.16 32.38,60.8 v32.38,67.78 | v53.34,69.05 53.34,73.5 54.6,74.77 54.6,77.94 53.34,79.21 53.34,83.66 52.7,84.29 52.7,88.1 53.34,88.73 P3.C19
A5  (via drill 0.5)
  Top 0.305: P1.C18 12.7,47.46 13.33,48.09 16.5,48.09 17.14,48.73 P2.14 U1.14 38.73,48.73 40,47.46 64.76,47.46 65.4,46.82 v69.84,46.82 | v67.3,92.55 v55.88,92.55
  Bottom 0.305: IC1.17 71.75,37.3 69.84,39.2 69.84,44.28 70.48,44.92 70.48,46.19 v69.84,46.82 70.48,47.46 71.75,47.46 71.75,50 71.11,50.63 71.11,79.84 71.75,81.11 71.75,82.39 70.48,83.66 69.21,83.66 68.57,84.29 68.57,88.1 67.3,89.37 v67.3,92.55 | v55.88,92.55 P3.C18
A6  (via drill 0.5)
  Top 0.305: v33.02,37.3 v57.15,37.3 IC1.4 | v33.02,46.19 U1.15 P2.15 v15.87,46.19 | P1.C17 15.23,50 v15.87,49.37
  Bottom 0.305: v33.02,46.19 v33.02,37.3 | P3.C17 58.41,83.66 60.96,80.48 60.96,67.14 61.59,66.51 61.59,63.97 60.96,63.34 60.96,62.7 60.32,62.06 60.32,61.43 60.96,60.8 60.96,56.35 62.23,55.08 62.23,45.55 57.15,43.02 v57.15,37.3 | v15.87,49.37 v15.87,46.19
A7  (via drill 0.5)
  Top 0.305: IC1.15 69.21,32.22 67.94,30.95 v58.41,30.95 | v58.41,42.38 40.63,42.38 40,43.02 38.09,43.02 37.46,42.38 34.29,42.38 33.02,43.65 U1.16 P2.16 24.12,43.65 23.49,44.28 19.68,44.28 19.05,43.65 v15.87,43.65 | v15.87,51.91 15.23,52.54 P1.C16
  Bottom 0.305: v58.41,30.95 v58.41,42.38 62.86,44.92 62.86,55.71 62.23,56.35 62.23,59.52 62.86,60.16 62.86,81.11 61.59,82.39 61.59,87.47 60.96,88.1 P3.C16 | v15.87,43.65 14.6,44.92 14.6,50.63 v15.87,51.91
A8  (via drill 0.5)
  Top 0.305: v55.88,32.22 IC1.6 | v55.88,39.84 40.63,39.84 40,39.2 34.29,39.2 32.38,41.11 U1.17 P2.17 22.22,41.11 21.59,40.48 20.95,40.48 20.32,41.11 v15.87,41.11 | v15.87,55.08 P1.C15 | v69.21,45.55 68.57,45.55 67.94,46.19 v60.96,46.19
  Bottom 0.305: v55.88,32.22 v55.88,39.84 55.88,43.65 59.69,45.55 60.32,46.19 v60.96,46.19 | v15.87,41.11 15.87,41.74 17.14,43.02 17.14,52.54 15.87,53.81 v15.87,55.08 | P3.C15 63.49,83.02 67.3,78.58 67.3,54.45 67.94,53.81 67.94,51.27 69.21,50 69.21,48.09 68.57,47.46 68.57,46.19 v69.21,45.55
A9  (via drill 0.5)
  Top 0.305: U1.18 P2.18 23.49,38.57 22.86,39.2 21.59,39.2 20.95,38.57 v18.41,38.57 | IC1.13 70.48,27.14 69.21,28.41 61.59,28.41 60.96,29.04 v33.65,29.04 | v17.77,57.62 P1.C14 50.16,57.62 52.06,55.71 v53.97,55.71 | v53.97,86.19 54.6,86.83 58.41,86.83 59.05,87.47 60.96,87.47 61.59,86.83 v67.3,86.83
  Bottom 0.305: v33.65,29.04 33.65,35.39 U1.18 | v17.77,57.62 18.41,56.35 v18.41,38.57 | v53.97,55.71 53.34,56.35 53.34,63.97 53.97,64.61 53.97,66.51 54.6,67.14 54.6,69.05 53.97,69.69 53.97,72.86 55.24,74.13 55.24,78.58 53.97,79.84 v53.97,86.19 | v67.3,86.83 67.3,88.1 66.03,89.37 P3.C14
A10  (via drill 0.5)
  Top 0.305: U1.19 P2.19 25.39,36.03 24.76,36.66 v19.68,36.66 | v32.38,29.04 33.65,27.77 34.92,27.77 35.55,28.41 60.32,28.41 61.59,27.14 IC1.8 | v19.05,60.16 18.41,60.16 17.77,59.52 12.7,59.52 12.06,60.16 P1.C13 | v19.05,88.73 20.32,88.73 21.59,90 21.59,91.91 22.22,92.55 26.66,92.55 27.3,91.91 27.93,91.91 29.84,93.81 68.57,93.81 P3.C13
  Bottom 0.305: v32.38,29.04 32.38,34.12 U1.19 | v19.68,36.66 19.68,39.2 19.05,39.84 19.05,44.92 19.68,45.55 19.68,49.37 19.05,50 v19.05,60.16 19.05,69.69 19.68,70.32 19.68,83.02 19.05,83.66 v19.05,88.73
A11  (via drill 0.5)
  Top 0.305: U1.20 P2.20 v14.6,33.49 | IC1.11 70.48,22.06 69.21,23.33 57.15,23.33 56.51,23.96 48.89,23.96 48.26,23.33 46.35,23.33 45.72,23.96 37.46,23.96 36.83,23.33 34.92,23.33 v34.29,23.96 | v14.6,62.7 P1.C12 | v14.6,81.11 19.05,81.11 22.86,84.92 49.52,84.92 50.8,83.66 63.49,83.66 64.76,84.92 69.84,84.92 v71.11,86.19
  Bottom 0.305: U1.20 30.48,30.31 v34.29,23.96 | v14.6,33.49 14.6,37.3 13.96,37.94 13.96,42.38 13.33,43.02 13.33,57.62 14.6,58.89 v14.6,62.7 v14.6,81.11 | v71.11,86.19 P3.C12
A12  (via drill 0.5)
  Top 0.305: P2.22 U1.22 | IC2.1 27.93,21.42 29.2,22.7 33.02,22.7 33.65,22.06 v43.17,22.06
  Bottom 0.305: P2.22 42.54,36.03 43.81,34.76 43.81,31.58 43.17,30.95 v43.17,22.06
A13  (via drill 0.5)
  Top 0.305: U1.23 P2.23 33.02,38.57 31.74,39.84 v24.76,39.84
  Bottom 0.305: v24.76,39.84 24.76,35.39 25.39,34.76 24.76,34.12 24.76,26.5 22.22,23.96 22.22,19.52 22.86,18.88 IC2.2
A14  (via drill 0.5)
  Top 0.305: U1.24 P2.24 40.63,41.11 40,40.48 v38.73,40.48 | IC2.3 27.3,16.34 28.57,17.61 34.92,17.61 36.19,18.88 v38.09,18.88
  Bottom 0.305: v38.09,18.88 38.09,26.5 39.37,27.77 39.37,36.66 38.73,37.3 v38.73,40.48
A15  (via drill 0.5)
  Top 0.305: U1.25 P2.25 v34.92,43.65 | IC2.6 27.93,8.73 29.2,10 v34.29,10
  Bottom 0.305: v34.29,10 34.29,20.15 36.83,23.33 36.83,29.04 34.92,30.95 v34.92,43.65
BA12  (via drill 0.5)
  Top 0.305: v76.83,76.67 69.84,76.67 68.57,75.4 IC3.2 54.6,75.4 53.34,76.67 51.43,76.67 50.8,76.03 48.89,76.03 48.26,75.4 34.29,75.4 33.65,76.03 31.74,76.03 31.11,75.4 25.39,75.4 24.12,74.13 v17.14,74.13 | P1.C11 11.43,65.24 12.06,65.88 15.87,65.88 16.5,65.24 v17.77,65.24
  Bottom 0.305: v76.83,76.67 76.83,80.48 73.65,83.66 P3.C11 | v17.77,65.24 17.77,69.69 17.14,70.32 v17.14,74.13
BA13  (via drill 0.5)
  Top 0.305: v79.37,75.4 IC3.19 | P1.C10 12.7,67.78 13.96,69.05 16.5,69.05 17.77,67.78 31.11,67.78 32.38,66.51 36.19,66.51 37.46,65.24 38.09,65.24 38.73,65.88 40,65.88 40.63,65.24 46.35,65.24 47.62,63.97 50.16,63.97 50.8,64.61 56.51,64.61 57.15,65.24 58.41,65.24 59.69,63.97 v79.37,63.97
  Bottom 0.305: P3.C10 76.19,87.47 79.37,84.29 v79.37,75.4 79.37,71.59 78.73,70.95 78.73,67.14 79.37,66.51 v79.37,63.97
BA14  (via drill 0.5)
  Top 0.305: v80,67.78 IC3.16 67.94,67.78 66.67,66.51 57.15,66.51 56.51,65.88 50.16,65.88 49.52,66.51 v48.26,66.51 | P1.C9 32.38,70.32 33.02,70.95 35.55,70.95 36.19,70.32 v47.62,70.32
  Bottom 0.305: v80,67.78 80,70.95 80.64,71.59 80.64,84.92 78.73,86.83 P3.C9 | v47.62,70.32 46.98,69.69 46.98,67.14 v48.26,66.51
BA15  (via drill 0.5)
  Top 0.305: v81.27,69.05 67.94,69.05 66.67,67.78 IC3.5 56.51,67.78 55.24,66.51 51.43,66.51 50.16,67.78 v48.26,67.78 | P1.C8 31.74,72.86 33.02,71.59 39.37,71.59 40.63,72.86 v48.26,72.86
  Bottom 0.305: v81.27,69.05 P3.C8 | v48.26,72.86 48.26,71.59 48.89,70.95 48.89,69.69 48.26,69.05 v48.26,67.78
BA16  (via drill 0.5)
  Top 0.305: P1.C7 22.86,75.4 25.39,77.94 46.35,77.94 47.62,76.67 50.16,76.67 50.8,77.3 53.97,77.3 54.6,76.67 v59.05,76.67 | v59.69,65.24 IC3.6 | v59.05,79.21 66.67,79.21 67.94,79.84 v83.81,79.84
  Bottom 0.305: v59.69,65.24 59.69,73.5 59.05,74.13 v59.05,76.67 v59.05,79.21 | v83.81,79.84 P3.C7
BA17  (via drill 0.5)
  Top 0.305: v12.7,92.55 13.96,93.18 20.32,93.18 21.59,94.45 69.84,94.45 71.75,92.55 73.65,92.55 75.56,94.45 85.08,94.45 86.35,93.18 P3.C6 | IC3.15 81.27,65.24 82.54,66.51 v86.35,66.51
  Bottom 0.305: P1.C6 12.06,79.84 12.06,92.55 v12.7,92.55 | v86.35,66.51 86.35,76.03 84.45,77.94 84.45,79.21 86.35,81.11 P3.C6
BA18  (via drill 0.5)
  Top 0.305: P1.C5 12.7,80.48 13.33,79.84 19.05,79.84 23.49,84.29 48.89,84.29 51.43,81.75 53.97,81.75 55.24,83.02 64.13,83.02 65.4,84.29 76.83,84.29 v77.46,84.92 78.1,84.29 v88.89,84.29 | v77.46,57.62 IC3.12
  Bottom 0.305: v88.89,84.29 P3.C5 | v77.46,84.92 77.46,77.94 78.1,77.3 78.1,75.4 77.46,74.77 v77.46,57.62
BA19  (via drill 0.5)
  Top 0.305: P1.C4 v14.6,83.02 | v14.6,88.1 16.5,88.1 17.14,87.47 22.22,87.47 22.86,88.1 27.3,88.1 27.93,87.47 38.09,87.47 40,89.37 64.13,89.37 64.76,88.73 v65.4,88.73 66.03,89.37 80,89.37 80.64,88.73 v91.43,88.73 | v69.84,57.62 IC3.9
  Bottom 0.305: v14.6,83.02 v14.6,88.1 | v65.4,88.73 65.4,85.56 69.21,82.39 69.21,81.11 70.48,79.84 70.48,58.89 v69.84,57.62 | v91.43,88.73 P3.C4
D0  (via drill 0.5)
  Top 0.305: v58.41,63.97 51.43,63.97 50.8,63.34 46.98,63.34 46.35,63.97 U1.33 P2.33 40.63,63.97 40,63.34 38.73,63.34 38.09,63.97 36.19,63.97 34.92,65.24 24.12,65.24 22.86,63.97 16.5,63.97 15.87,64.61 v13.33,64.61 | v58.41,72.86 IC3.3 67.94,72.86 69.21,74.13 76.83,74.13 78.1,72.86 IC4.2 | v55.88,85.56 55.24,85.56 54.6,84.92 52.06,84.92 50.8,86.19 48.26,86.19 47.62,87.47 v46.98,87.47 | P1.A22 8.88,37.3 10.16,38.57 v12.06,38.57
  Bottom 0.305: v58.41,63.97 v58.41,72.86 58.41,74.13 57.78,74.77 57.78,81.75 55.88,83.66 v55.88,85.56 | v46.98,87.47 46.98,91.91 45.72,93.18 P3.A22 | v12.06,38.57 13.33,39.84 13.33,41.74 12.7,42.38 12.7,58.25 13.96,59.52 13.96,61.43 13.33,62.06 v13.33,64.61
D1  (via drill 0.5)
  Top 0.305: v55.88,62.06 52.06,62.06 51.43,61.43 U1.32 P2.32 35.55,61.43 34.29,62.7 24.12,62.7 22.86,61.43 18.41,61.43 17.77,60.8 v12.7,60.8 | P1.A21 8.25,39.84 9.52,41.11 v12.06,41.11 | IC4.12 88.26,70.32 86.99,71.59 78.1,71.59 76.83,72.86 IC3.18 69.84,72.86 68.57,71.59 v56.51,71.59 52.7,75.4 v51.43,75.4
  Bottom 0.305: v55.88,62.06 55.88,64.61 57.15,65.88 57.15,70.95 v56.51,71.59 | P3.A21 48.26,93.18 49.52,91.91 49.52,83.66 51.43,81.75 v51.43,75.4 | v12.06,41.11 12.06,60.16 v12.7,60.8
D2  (via drill 0.5)
  Top 0.305: v52.06,58.89 U1.31 P2.31 35.55,58.89 34.29,60.16 22.22,60.16 20.95,58.89 v6.98,58.89 | v52.7,67.78 55.24,67.78 56.51,69.05 66.67,69.05 67.94,70.32 IC3.17 | P1.A20 6.35,42.38 6.98,43.02 v6.98,46.19
  Bottom 0.305: v52.06,58.89 52.06,59.52 52.7,60.16 v52.7,67.78 52.06,68.41 52.06,69.05 52.7,69.69 52.7,74.13 53.97,75.4 53.97,77.3 52.7,78.58 52.7,83.02 52.06,83.66 52.06,91.91 50.8,93.18 P3.A20 | v6.98,46.19 v6.98,58.89
D3  (via drill 0.5)
  Top 0.305: P2.30 U1.30 50.16,56.35 52.06,54.45 v54.6,54.45 | v55.24,69.69 56.51,70.32 IC3.4 | v6.98,28.41 18.41,28.41 20.32,30.31 46.98,30.31 47.62,29.68 48.89,29.68 50.16,30.95 v52.7,30.95
  Bottom 0.305: P3.A19 53.34,93.18 54.6,91.91 54.6,87.47 55.24,86.83 55.24,86.19 54.6,85.56 54.6,80.48 55.88,79.21 55.88,73.5 54.6,72.22 54.6,70.32 v55.24,69.69 55.88,69.05 55.88,67.14 54.6,65.88 54.6,63.97 53.97,63.34 53.97,56.98 55.24,55.71 v54.6,54.45 54.6,53.81 53.97,53.17 53.97,50.63 55.88,48.73 55.88,48.09 52.7,44.92 v52.7,30.95 | P1.A19 6.98,43.65 v6.98,28.41
D4  (via drill 0.5)
  Top 0.305: v60.96,53.81 55.24,53.81 54.6,53.17 53.97,53.17 53.34,53.81 U1.29 P2.29 v37.46,53.81 | v59.69,62.7 IC3.7 | P1.A18 8.25,47.46 9.52,46.19 12.7,46.19 13.96,47.46 v37.46,47.46
  Bottom 0.305: v60.96,53.81 60.96,54.45 59.69,55.71 59.69,58.25 60.32,58.89 60.32,60.16 59.69,60.8 v59.69,62.7 59.69,63.34 60.96,64.61 60.96,65.88 60.32,66.51 60.32,79.84 57.15,83.66 57.15,92.55 55.88,93.81 P3.A18 | v37.46,47.46 v37.46,53.81
D5  (via drill 0.5)
  Top 0.305: P2.28 U1.28 54.6,51.27 55.24,51.91 v55.88,51.91 | v55.88,60.8 57.78,60.8 58.41,61.43 v61.59,61.43 70.48,61.43 71.75,62.7 IC3.14 | P1.A17 8.25,50 9.52,51.27 15.23,51.27 15.87,50.63 16.5,50.63 17.14,51.27 v21.59,51.27 | v21.59,43.02 22.86,42.38 33.02,42.38 33.65,41.74 v39.37,41.74
  Bottom 0.305: v55.88,51.91 56.51,52.54 56.51,56.98 55.24,58.25 55.24,59.52 55.88,60.16 v55.88,60.8 | v21.59,51.27 v21.59,43.02 | v39.37,41.74 39.37,45.55 40,46.19 40,48.09 39.37,48.73 39.37,51.27 P2.28 | P3.A17 58.41,93.18 59.69,91.91 59.69,83.66 62.23,80.48 62.23,62.06 v61.59,61.43
D6  (via drill 0.5)
  Top 0.305: v57.78,48.73 U1.27 P2.27 40.63,48.73 40,49.37 40,50 36.83,50 34.29,52.54 16.5,52.54 15.23,53.81 9.52,53.81 8.25,52.54 P1.A16 | v56.51,58.25 57.15,58.25 57.78,58.89 v63.49,58.89 68.57,58.89 69.84,60.16 IC3.13
  Bottom 0.305: v57.78,48.73 57.78,49.37 56.51,50.63 56.51,51.27 57.15,51.91 57.15,57.62 v56.51,58.25 | P3.A16 60.96,93.18 62.23,91.91 62.23,83.02 63.49,81.75 v63.49,58.89
D7  (via drill 0.5)
  Top 0.305: v59.05,46.19 U1.26 P2.26 40,46.19 v38.73,47.46 | v59.05,60.16 IC3.8 v68.57,60.16 | P1.A15 8.25,55.08 9.52,56.35 18.41,56.35 19.68,55.08 v38.73,55.08
  Bottom 0.305: v59.05,46.19 59.69,46.82 59.69,51.91 59.05,52.54 v59.05,60.16 | v38.73,55.08 v38.73,47.46 | v68.57,60.16 68.57,60.8 67.94,61.43 67.94,79.21 65.4,82.39 64.13,83.66 64.13,89.37 64.76,90 64.76,91.91 63.49,93.18 P3.A15
ENIO  (via drill 0.5)
  Top 0.305: v68.57,36.03 78.73,36.03 79.37,36.66 v93.34,36.66
  Bottom 0.305: IC10.2 v68.57,36.03 | v93.34,36.66 93.34,56.98 93.97,57.62 93.97,60.16 IC4.9
ENMAP
  Top 0.305: IC10.3 66.03,10.63 67.3,9.36 71.75,9.36 76.19,13.81 IC7.4
  Bottom 0.305: IC7.4 81.27,13.81 81.91,14.44 81.91,22.7 80.64,23.96 80.64,62.06 IC4.5
GND  (via drill 0.5)
  Top 0.305: 109.21,67.78 C15.-
  Top 0.406: C6.1 19.05,65.24 17.77,66.51 v9.52,66.51
  Top 0.61: P2.21 U1.21 53.97,33.49 55.24,34.76 IC1.5 | U1.1 38.09,81.75 39.37,83.02 47.62,83.02 v48.89,81.75 | v49.52,79.21 57.15,79.21 58.41,80.48 65.4,80.48 66.67,81.75 C2.1 67.94,81.11 68.57,80.48 81.27,80.48 81.91,81.11 84.45,81.11 C7.1 86.35,79.84 88.89,82.39 R17.1 | P1.C32 v20.32,11.9 20.95,11.27 | 20.95,11.27 IC2.5 | 20.95,11.27 20.95,4.92 22.22,3.64 IC2.8 | v54.6,22.7 55.88,22.7 56.51,22.06 IC1.10 68.57,22.06 69.84,20.79 v74.92,20.79 | IC1.9 v69.84,24.6 71.11,23.33 v74.92,23.33 75.56,23.33 77.46,25.23 C12.1 83.81,23.96 91.43,23.96 93.34,25.87 C4.1 96.51,25.87 97.78,24.6 99.69,24.6 100.96,25.87 v102.23,25.87 v109.21,25.87 | C14.1 75.56,9.36 78.73,6.18 IC7.7 81.91,6.18 83.18,4.92 92.07,4.92 IC9.7 95.88,6.18 97.15,7.46 QG1.7 | C13.1 114.29,65.24 111.75,67.78 109.21,67.78 C16.- v96.51,67.78 | IC6.7 100.96,41.74 102.23,40.48 120.64,40.48 C8.1 | C3.1 119.38,54.45 119.38,56.35 117.47,58.25 102.23,58.25 100.96,56.98 IC5.7 90.16,55.71 88.89,56.98 86.99,56.98 C10.1 82.54,55.71 81.91,56.35 71.75,56.35 70.48,55.08 v68.57,55.08 IC3.10 | v50.8,3.64 v50.8,9.36
  Top 1.27: U1.1 P2.1 v24.12,81.75 | P1.C1 P3.C32 | P3.A28 P3.A29 P3.A30 P3.A31 P3.A32 | JP3.1 117.47,85.56 109.85,85.56 | 109.85,85.56 107.94,85.56 107.94,88.73 107.31,89.37 C17.- 100.32,89.37 P3.C1 | 109.85,85.56 JP3.4
  Bottom 0.305: IC1.5 64.13,34.76 | C13.1 116.2,65.24
  Bottom 0.406: 7.62,66.51 v9.52,66.51
  Bottom 0.61: v48.89,81.75 48.89,80.48 v49.52,79.21 | v20.32,11.9 22.22,13.81 IC2.4 25.39,13.81 | 25.39,13.81 26.66,15.08 C5.1 | v54.6,22.7 54.6,13.81 53.34,12.54 IC10.8 v50.8,9.36 | C14.1 v74.92,20.79 v74.92,23.33 | 64.13,29.68 62.86,28.41 62.86,25.87 64.13,24.6 IC1.9 IC1.10 | 64.13,29.68 IC1.7 | 64.13,29.68 62.86,30.95 62.86,33.49 64.13,34.76 62.86,36.03 62.86,38.57 64.13,39.84 IC1.3 66.67,39.84 67.94,41.11 C1.1 67.3,48.73 65.4,50.63 IC3.10 | v69.84,24.6 69.84,28.41 71.11,29.68 IC1.14 73.65,29.68 74.92,30.95 74.92,33.49 73.65,34.76 | 73.65,34.76 IC1.16 | 73.65,34.76 74.92,36.03 74.92,38.57 73.65,39.84 IC1.18 | QG1.7 107.94,7.46 109.21,8.73 v109.21,25.87 C11.1 | IC9.7 94.61,6.18 96.51,8.09 96.51,20.79 95.88,21.42 C4.1 | 80.64,6.18 81.91,6.18 82.54,6.82 C12.1 82.54,31.58 83.18,32.22 IC8.8 | v102.23,25.87 102.23,37.94 100.96,39.2 IC6.7 100.96,44.28 102.23,45.55 102.23,50.63 100.96,51.91 IC5.7 100.96,58.25 102.86,60.16 C16.- | C8.1 118.74,43.65 118.74,51.27 C3.1 120.64,60.8 116.2,65.24 | P3.C1 95.88,87.47 96.51,86.83 96.51,84.29 R17.1 94.61,78.58 95.24,77.94 95.24,77.3 95.88,76.67 95.88,68.41 v96.51,67.78 | IC4.7 83.81,57.62 C10.1 | 25.39,13.81 27.3,11.9 27.3,4.92 29.84,2.38 41.27,2.38 41.91,3.01 | 41.91,3.01 P2.21 | 41.91,3.01 42.54,2.38 50.16,2.38 v50.8,3.64 | C2.1 67.94,81.11 69.21,79.84 69.21,61.43 69.84,60.8 69.84,59.52 68.57,58.25 v68.57,55.08
  Bottom 1.27: C6.1 21.59,67.14 22.86,68.41 22.86,72.86 23.49,73.5 23.49,81.11 v24.12,81.75 C9.- P3.C32 P3.A32 20.32,97.62 20.95,98.26 22.86,98.26 | P1.C1 P1.A1 7.62,88.73 7.62,66.51 7.62,64.61 8.25,63.34 8.25,23.33 P1.A28 P1.A29 P1.A30 P1.A31 P1.A32 P1.C32 | P3.C1 P3.A1 99.05,96.99 97.78,98.26 30.48,98.26 | 27.93,98.26 30.48,98.26 | 25.39,98.26 27.93,98.26 | 22.86,98.26 25.39,98.26 | P3.A28 30.48,98.26 | P3.A29 27.93,98.26 | P3.A30 25.39,98.26 | P3.A31 22.86,98.26
  pour Bottom (isolate 0.813): 1.9,98.89 123.18,98.89 123.18,2.38 1.9,2.38 1.9,99.53
N$1
  Top 0.305: JP1.2 113.02,53.17 113.66,53.81 IC5.2
N$2
  Top 0.305: R1.1 101.59,84.92 102.86,83.66 IC14.1 101.59,81.75 100.96,82.39 R17.2
N$5  (via drill 0.5)
  Top 0.305: v94.61,39.2 v106.04,39.2
  Bottom 0.305: IC9.2 94.61,18.88 95.24,19.52 95.24,23.96 94.61,24.6 v94.61,39.2 | v106.04,39.2 IC6.5
N$7  (via drill 0.5)
  Top 0.305: IC7.6 83.18,8.73 84.45,10 v115.56,10
  Bottom 0.305: v115.56,10 115.56,26.5 114.93,27.14 114.93,51.27 116.2,52.54 IC5.1
N$9
  Bottom 0.305: IC7.5 79.37,11.27 77.46,13.17 77.46,15.08 78.73,16.34 IC7.3
PHI0  (via drill 0.5)
  Top 0.305: P1.C28 20.32,22.06 21.59,23.33 33.65,23.33 34.29,22.7 37.46,22.7 38.09,23.33 45.08,23.33 45.72,22.7 v50.8,22.7 | v50.16,74.77 48.89,74.13 U1.37 P2.37 40.63,74.13 40,74.77 v32.38,74.77
  Bottom 0.305: v50.8,22.7 50.8,37.3 51.43,37.94 51.43,40.48 50.8,41.11 50.8,55.71 49.52,56.98 49.52,61.43 50.8,62.7 50.8,74.13 v50.16,74.77 | v32.38,74.77 32.38,84.29 30.48,86.19 P3.C28
PHI1  (via drill 0.5)
  Top 0.305: P2.3 U1.3 v34.29,76.67 | P1.C27 18.41,24.6 20.32,26.5 31.11,26.5 31.74,25.87 34.92,25.87 v35.55,25.23
  Bottom 0.305: v35.55,25.23 35.55,26.5 34.92,27.14 34.92,29.68 34.29,30.31 34.29,42.38 33.65,43.02 33.65,44.92 34.29,45.55 34.29,68.41 33.02,69.69 33.02,72.22 34.29,73.5 v34.29,76.67 34.29,88.73 33.02,90 P3.C27
PHI2  (via drill 0.5)
  Top 0.305: P1.C26 18.41,27.14 19.68,28.41 22.22,28.41 22.86,27.77 24.12,27.77 25.39,29.04 29.84,29.04 32.38,26.5 48.26,26.5 48.89,25.87 v49.52,25.87 v52.06,25.87 | v48.26,77.94 46.98,79.21 U1.39 P2.39 v35.55,79.21 | v52.06,22.06 52.7,22.06 53.34,21.42 59.69,21.42 61.59,19.52 67.3,19.52 67.94,20.15 73.02,20.15 73.65,19.52 78.1,19.52 78.73,20.15 90.16,20.15 91.43,21.42 IC9.1 | v85.72,29.04 v93.34,29.04 95.88,29.04 96.51,29.68 99.05,29.68 99.69,29.04 104.13,29.04 106.67,31.58 v112.39,31.58 | IC6.2 IC6.1
  Bottom 0.305: v49.52,25.87 49.52,37.3 48.89,37.94 48.89,41.74 49.52,42.38 49.52,48.73 48.26,50 48.26,62.7 49.52,63.97 49.52,72.86 48.26,74.13 v48.26,77.94 | v35.55,79.21 P3.C26 | v52.06,25.87 v52.06,22.06 | IC9.1 v93.34,29.04 | v85.72,29.04 85.72,37.94 IC8.6 | IC6.2 113.66,39.84 112.39,38.57 v112.39,31.58
R/-W  (via drill 0.5)
  Top 0.305: P1.C25 18.41,29.68 19.68,30.95 v48.26,30.95 49.52,32.22 53.97,32.22 55.24,33.49 v79.37,33.49 | v48.26,65.24 47.62,65.24 46.35,66.51 U1.34 P2.34 v37.46,66.51 | v79.37,50.63 IC8.1
  Bottom 0.305: v48.26,30.95 48.26,48.73 47.62,49.37 47.62,63.34 48.26,63.97 v48.26,65.24 | v37.46,66.51 38.09,67.78 38.73,68.41 38.73,70.32 37.46,71.59 37.46,74.77 38.09,75.4 38.09,86.19 38.73,86.83 38.73,89.37 38.09,90 P3.C25 | v79.37,33.49 v79.37,50.63
RDY  (via drill 0.5)
  Top 0.305: U1.2 P2.2 | P1.A26 8.25,27.14 9.52,25.87 18.41,25.87 19.68,27.14 24.76,27.14 25.39,27.77 v29.2,27.77
  Bottom 0.305: v29.2,27.77 29.2,77.94 U1.2
SYNC  (via drill 0.5)
  Top 0.305: v15.87,67.78 16.5,67.78 17.14,67.14 19.68,67.14 20.32,66.51 P2.7 U1.7 31.11,65.88 35.55,65.88 36.83,64.61 v39.37,64.61
  Bottom 0.305: P1.C24 15.87,32.22 15.87,37.3 14.6,38.57 14.6,43.02 13.96,43.65 13.96,56.98 15.87,58.89 v15.87,67.78 | P3.C24 40.63,88.1 43.81,84.92 43.81,68.41 43.17,67.78 40.63,67.78 39.37,66.51 v39.37,64.61
VCC  (via drill 0.5)
  Top 0.305: 92.7,65.24 92.07,65.24
  Top 0.406: 3.17,63.97 11.43,63.97 12.06,63.34 13.33,63.34 13.96,63.97 15.23,63.97 15.87,63.34 19.05,63.34 19.68,62.7 19.05,62.06 15.87,62.06 15.23,61.43 13.96,61.43 13.33,62.06 12.06,62.06 11.43,61.43 3.17,61.43
  Top 0.61: U1.8 34.92,63.97 36.19,62.7 51.43,62.7 52.06,63.34 57.15,63.34 v57.15,62.06 | v57.78,51.27 v69.84,51.27 | IC1.12 74.92,24.6 76.83,26.5 83.81,26.5 C12.2 90.8,25.23 92.7,27.14 97.15,27.14 C4.2 99.05,25.87 100.32,27.14 110.48,27.14 C11.2 v116.2,28.41 | v73.02,48.73 C1.2 | IC9.14 103.5,21.42 104.77,22.7 QG1.1 | C8.2 118.1,35.39 IC6.14 116.2,36.66 114.93,37.94 104.13,37.94 103.5,37.3 IC6.9 | IC5.14 118.1,48.09 C3.2 121.91,51.91 121.91,63.97 C13.2 113.66,72.22 104.77,72.22 102.86,74.13 IC14.3 99.69,73.5 95.88,73.5 | v73.65,81.75 C2.2 | v76.19,66.51 80.64,66.51 81.91,67.78 IC4.4 86.99,67.78 88.89,65.24 IC4.10 92.07,65.24 95.88,61.43 D2.C | 93.34,75.4 IC4.14 | 93.34,75.4 93.97,75.4 95.88,73.5 | 93.34,79.21 C7.2 | 93.34,79.21 93.34,75.4 | v93.34,80.48 93.34,79.21 | 92.7,65.24 93.97,66.51 93.97,71.59 95.88,73.5 | 3.17,13.17 21.59,13.17 22.22,12.54 v29.2,12.54 | v29.2,6.18 29.2,3.01 29.84,2.38 70.48,2.38 71.11,3.01 IC10.16 | 72.38,98.26 v72.38,93.81
  Top 0.813: U1.8 P2.8 24.12,63.97 22.86,62.7 C6.2 19.68,62.7
  Top 1.016: P1.C2 P1.C3
  Top 1.27: C9.+ P1.C3 8.25,85.56 7.62,86.19 7.62,88.1 | 3.17,13.17 3.17,61.43 3.17,63.97 3.17,91.91 3.81,92.55 7.62,92.55 | 7.62,92.55 9.52,94.45 17.77,94.45 18.41,95.08 18.41,96.99 19.68,98.26 72.38,98.26 99.05,98.26 100.96,96.36 100.96,93.81 | 100.96,93.81 102.86,91.91 C17.+ 111.12,91.91 112.39,90.64 | 112.39,90.64 114.93,90.64 JP3.2 | 112.39,90.64 JP3.3 | 100.96,93.81 97.78,93.81 96.51,92.55 P3.C2 P3.C3 | 7.62,92.55 7.62,88.1 | 7.62,88.1 P1.C2
  Bottom 0.305: 100.32,21.42 IC9.14 | C10.2 88.26,55.08
  Bottom 0.61: v57.15,62.06 57.15,59.52 57.78,58.89 v57.78,51.27 | v69.84,51.27 70.48,50.63 C1.2 | C5.2 29.2,22.06 29.84,21.42 IC2.16 29.2,18.88 v29.2,12.54 v29.2,6.18 | C11.2 114.29,25.87 QG1.14 | C12.2 85.08,23.96 IC7.14 | 100.32,21.42 98.42,23.33 C4.2 | 75.56,24.6 76.83,23.33 76.83,8.09 75.56,6.82 C14.2 72.38,4.28 IC10.16 | 75.56,24.6 IC1.12 | 75.56,24.6 75.56,29.04 76.19,29.68 76.19,43.02 74.29,44.92 IC1.20 v73.02,48.73 73.02,51.91 76.19,55.08 v76.19,66.51 76.19,74.77 75.56,75.4 75.56,77.3 74.92,77.94 IC3.20 73.02,79.84 73.65,80.48 v73.65,81.75 73.02,81.75 72.38,82.39 v72.38,93.81 | 88.26,55.08 90.8,52.54 IC8.16 | v116.2,28.41 IC6.14 | C3.2 120.64,50 122.55,48.09 122.55,39.84 C8.2 | C10.2 88.26,57.62 88.89,58.25 88.89,62.7 IC4.10 | v93.34,80.48 93.34,86.83 93.97,87.47 P3.C3
  pour Top (isolate 0.813): 1.9,98.89 123.18,98.89 123.18,37.3 115.56,37.3 115.56,2.38 1.9,2.38
VDD  (via drill 0.5)
  Top 0.305: v18.41,82.39 19.05,82.39 | 109.21,70.32 C15.+
  Top 0.61: P1.A9 8.25,70.32 9.52,71.59 v18.41,71.59 | 19.05,82.39 24.12,87.47 26.03,87.47 26.66,86.83 38.73,86.83 40.63,88.73 60.96,88.73 62.23,87.47 66.03,87.47 67.3,88.73 69.84,88.73 70.48,88.1 v77.46,88.1 78.73,88.1 80,86.83 93.97,86.83 94.61,86.19 R1.2 95.24,84.92 97.15,83.02 97.15,82.39 100.32,79.21 | C16.+ 109.21,70.32 | 100.32,79.21 IC14.2 | 100.32,79.21 D2.A
  Bottom 0.61: v18.41,71.59 v18.41,82.39 | v77.46,88.1 77.46,92.55 78.73,93.81 P3.A9 | D2.A 97.78,75.4 C16.+

### Text on the board
Top: V1.2A | PET-CSADAPTER | (C) A. Fachat
tPlace: Tantal | V1.2A | MAP | E....9 | CTRL | PET-CSADAPTER | (C) A. Fachat